# EasyEDA schematic 1-Schematic_电机限流模块 （MOS管）.json
TITLE: Sheet_1; REV: 1.0; Date: 2026-02-02; Sheet: 1/1; Drawn By: ybyllcc; Company: Your Company
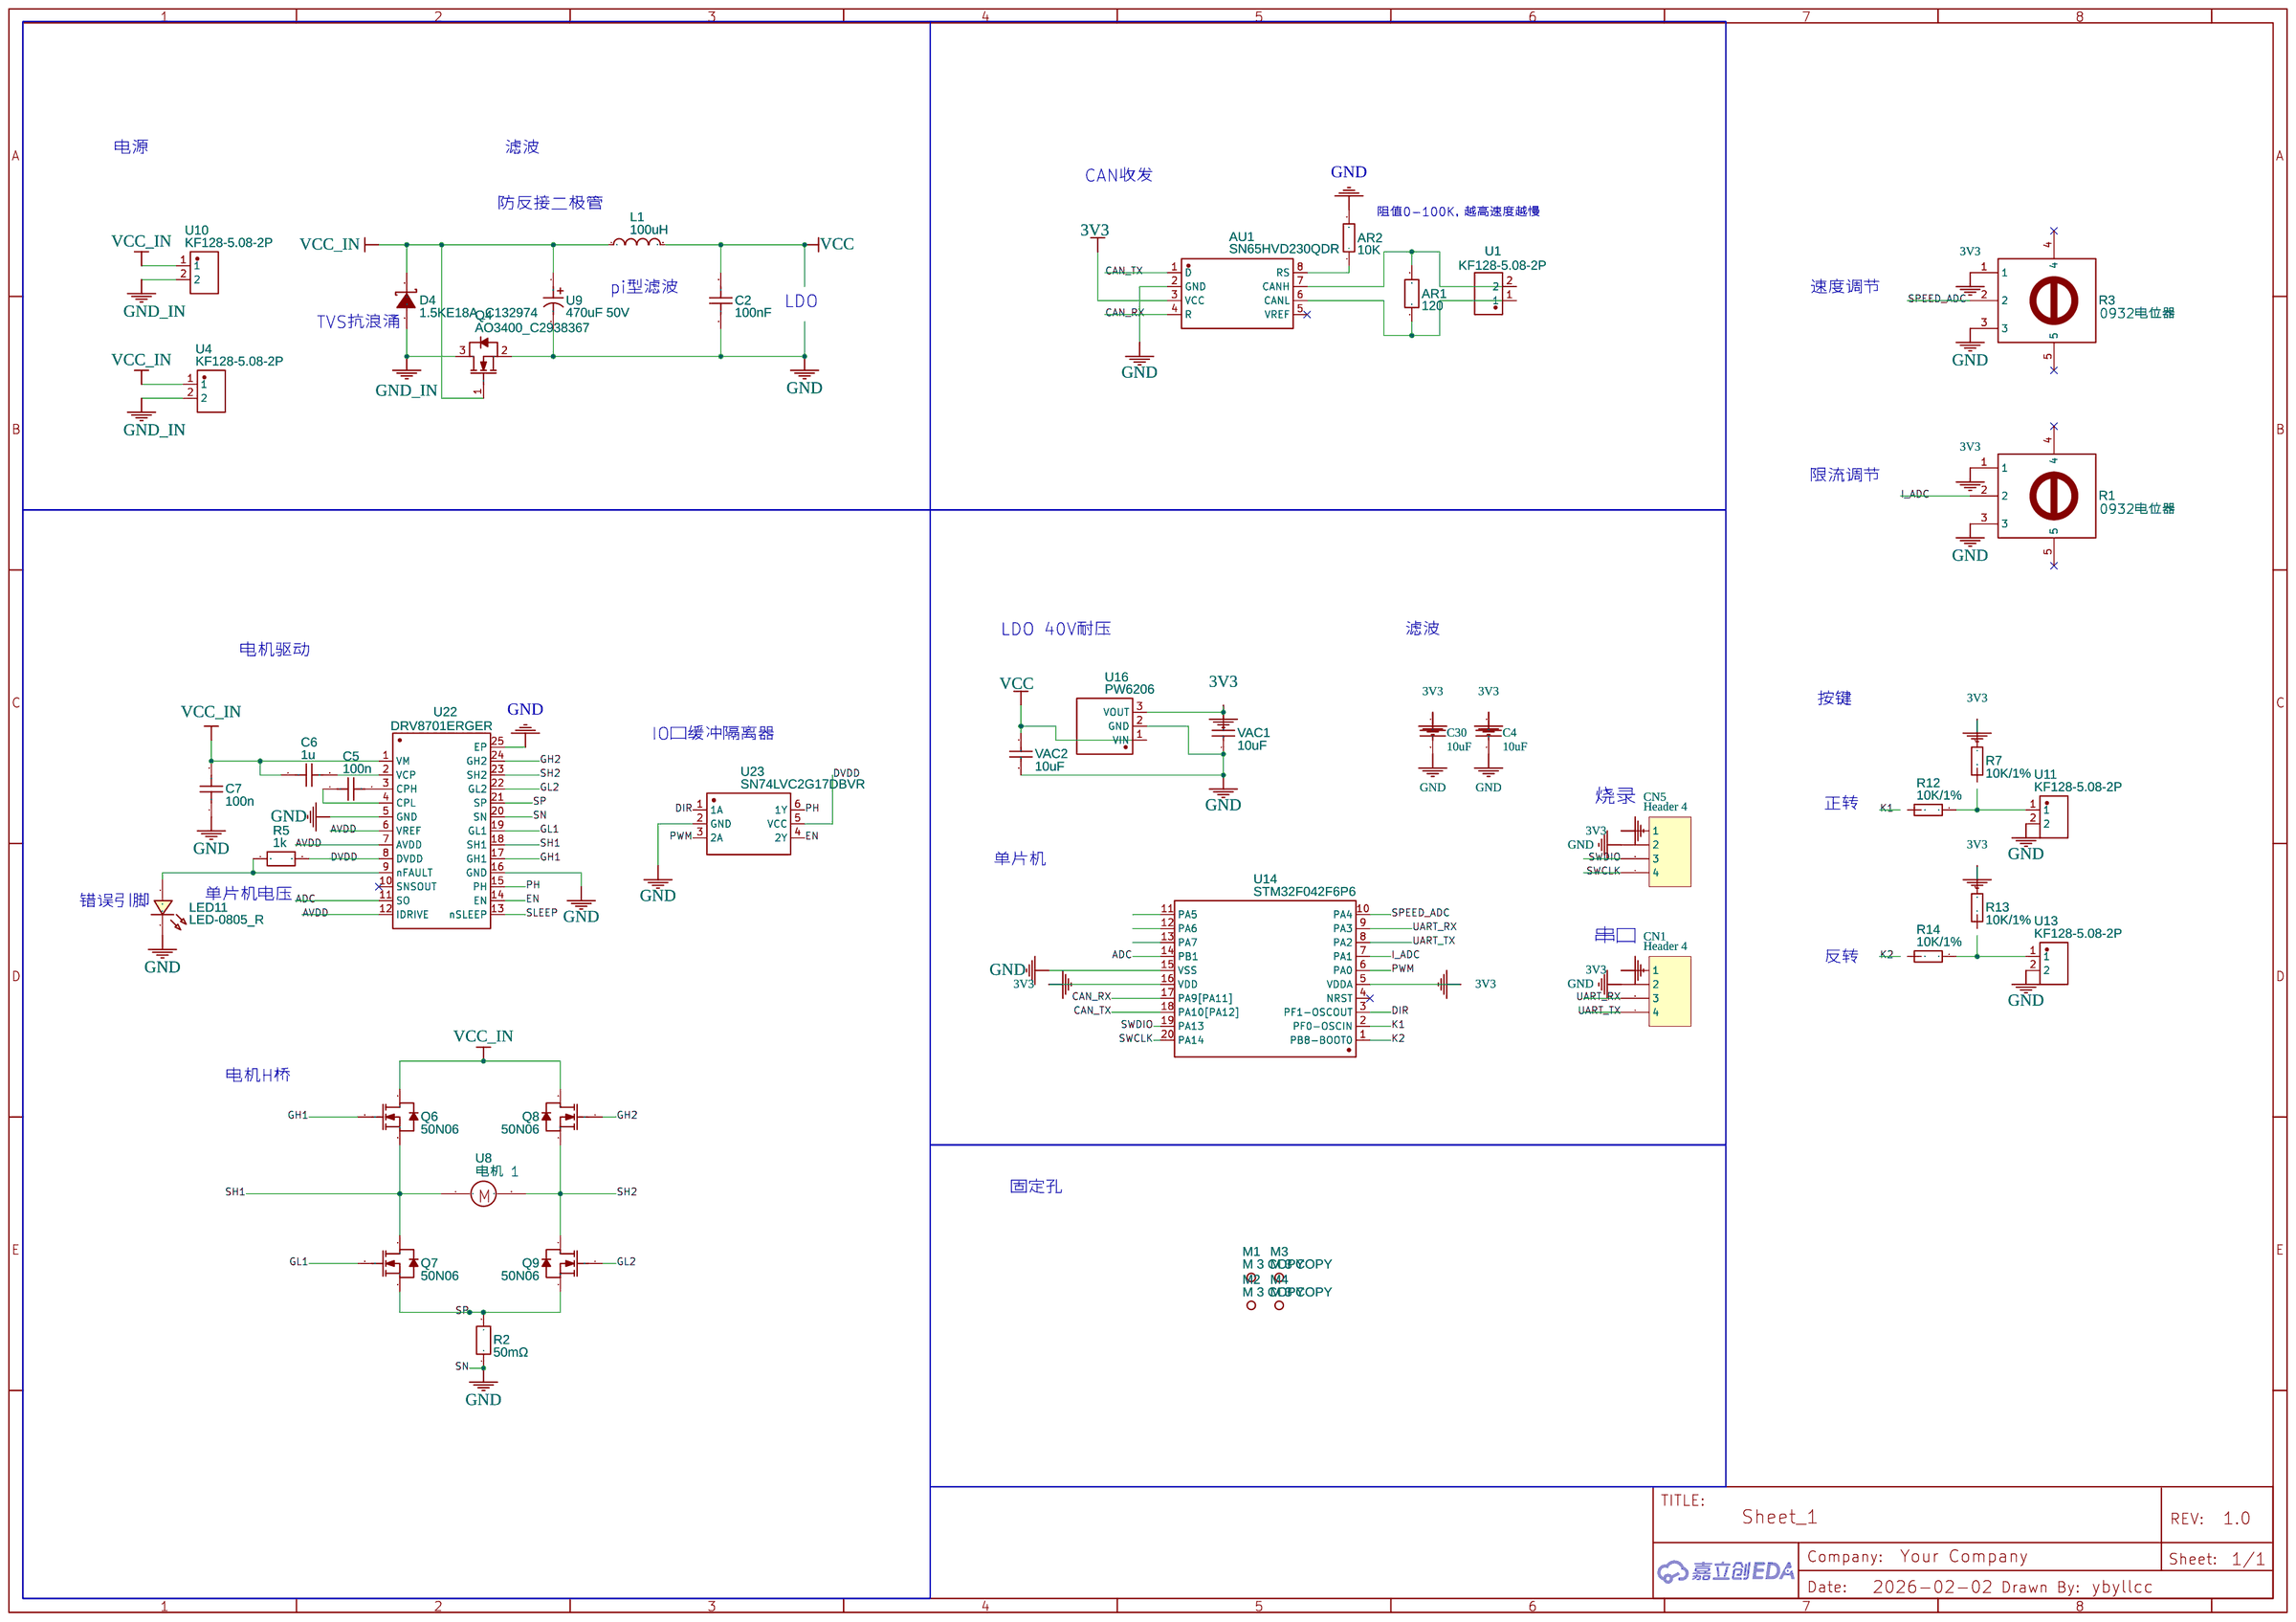
[diagram p0: schematic sheet]

## Parts
AR1  120  [R0603]
AR2  10K  [R0603]
AU1  SN65HVD230QDR  [SOIC-8_L5.0-W4.0-P1.27-LS6.0-BL]
C2  100nF  [C0603]
C4  10uF  [C0603]
C5  100n  [C0603]
C6  1u  [C0603]
C7  100n  [C0603]
C30  10uF  [C0603]
CN1  Header 4  [HDR1X4]
CN5  Header 4  [HDR1X4]
D4  1.5KE18A_C132974  [DO-201_BD5.3-L9.5-P13.50-D1.4-FD]
L1  100uH  [IND-SMD_L5.0-W5.0_FNR50XXS]
LED11  LED-0805_R  [LED0805_GREEN]
M1  M 3 COPY  [M3 固定螺丝过孔 周边不覆铜 圆弧]
M2  M 3 COPY  [M3 固定螺丝过孔 周边不覆铜 圆弧]
M3  M 3 COPY  [M3 固定螺丝过孔 周边不覆铜 圆弧]
M4  M 3 COPY  [M3 固定螺丝过孔 周边不覆铜 圆弧]
Q4  AO3400_C2938367  [SOT-23_L2.9-W1.3-P1.90-LS2.4-BR]
Q6  50N06  [TO-252-2_L6.6-W6.1-P4.57-LS10.1-BR-CW]
Q7  50N06  [TO-252-2_L6.6-W6.1-P4.57-LS10.1-BR-CW]
Q8  50N06  [TO-252-2_L6.6-W6.1-P4.57-LS10.1-BR-CW]
Q9  50N06  [TO-252-2_L6.6-W6.1-P4.57-LS10.1-BR-CW]
R1  0932电位器  [0932立式电位器]
R2  50mΩ  [R2512]
R3  0932电位器  [0932立式电位器]
R5  1k  [R0603]
R7  10K/1%  [0603_R_JX]
R12  10K/1%  [0603_R_JX]
R13  10K/1%  [0603_R_JX]
R14  10K/1%  [0603_R_JX]
U1  KF128-5.08-2P  [CONN-TH_P5.08_KF128-5.08-2P]
U4  KF128-5.08-2P  [CONN-TH_P5.08_KF128-5.08-2P]
U8  电机 1  [CONN-TH_P5.08_KF128-5.08-2P]
U9  470uF 50V  [CAP-TH_BD10.0-P5.00-D0.6-FD]
U10  KF128-5.08-2P  [CONN-TH_P5.08_KF128-5.08-2P]
U11  KF128-5.08-2P  [CONN-TH_P5.08_KF128-5.08-2P]
U13  KF128-5.08-2P  [CONN-TH_P5.08_KF128-5.08-2P]
U14  STM32F042F6P6  [TSSOP-20_L6.5-W4.4-P0.65-LS6.4-BL]
U16  PW6206  [SOT-89-3_L4.5-W2.5-P1.50-LS4.2-BR]
U22  DRV8701ERGER  [VQFN-24_L4.0-W4.0-P0.50-BL-EP2.5]
U23  SN74LVC2G17DBVR  [SOT-23-6_L2.9-W1.6-P0.95-LS2.8-BL]
VAC1  10uF  [C0603]
VAC2  10uF  [C0603]

## Library data of the parts
AR1 = R_0603_EU: Contributor: LCEDA_Lib
AR2 = RMC06035.1K1%N: Supplier: LCSC; Supplier Part: C269716; Manufacturer: Tyohm; Contributor: LCSC
AU1 = SN65HVD230QDR: Supplier: LCSC; Supplier Part: C16468; Manufacturer: Texas Instruments; Contributor: LCSC; LCSC Assembly: Yes; SMT Type: Extend
C2 = CGA0603X7R104K500JT: Supplier: LCSC; Supplier Part: C6119867; Manufacturer: HRE(芯声); JLCPCB Part Class: Extended Part; Contributor: lcsc
C5-C7 = C_0603_US: Contributor: LCEDA_Lib
CN1 CN5 = -: LatestRevisionDate: 17-Jul-2002; LatestRevisionNote: Re-released for DXP Platform.; Publisher: Altium Limited
D4 = 1.5KE18A_C132974: Contributor: LCSC; Supplier: LCSC; Manufacturer: ST(意法半导体); Manufacturer Part: 1.5KE18A; Supplier Part: C132974; JLCPCB Part Class: Extended Part
L1 = FNR5040S101MT: Contributor: LCSC; Supplier: LCSC; Manufacturer: cjiang(长江微电); Supplier Part: C167979; JLCPCB Part Class: Extended Part
LED11 = LED-0805_G: Manufacturer: 国星光电; Manufacturer Part: NCD0805G1; Supplier Part: C84260; Contributor: LCEDA_Lib; Package Display: No
M1 M2 M4 = M 3: Supplier Part: M3; Contributor: hanhan11223
M3 = M 3: Contributor: hanhan11223
Q4 = AO3400_C2938367: Contributor: LCSC; Supplier: LCSC; Supplier Part: C2938367; Manufacturer: GOODWORK(固得沃克); Manufacturer Part: AO3400; JLCPCB Part Class: Extended Part
Q6-Q9 = 50N06: Contributor: LCSC; Supplier: LCSC; Supplier Part: C668201; Manufacturer: UMW(友台半导体); JLCPCB Part Class: Extended Part
R1 R3 = 0932电位器: Contributor: zhaoji
R2 = RE2512F3R010: Supplier: LCSC; Supplier Part: C46961753; Manufacturer: JIERR(捷而瑞); Contributor: lcsc; JLCPCB Part Class: Extended Part
R5 = R_0805_EU: Contributor: LCEDA_Lib
R7 R12-R14 = Resistor: Supplier: LCSC
U1 U4 U10 U11 U13 = KF128-5.08-2P: Contributor: LCSC; Supplier: LCSC; Supplier Part: C474952; Manufacturer: KEFA(科发); Manufacturer Part: KF128-5.08-2P-AA; JLCPCB Part Class: Extended Part
U8 = 电机: Manufacturer: 周爽; Supplier Part: 电机-ZS; Contributor: MCqie
U9 = ERJ1HM471G16C35T: Supplier: LCSC; Supplier Part: C2916286; Manufacturer: AISHI(艾华集团); Contributor: lcsc; JLCPCB Part Class: Extended Part
U14 = STM32F042F6P6: Supplier: LCSC; Manufacturer: ST(意法半导体); Supplier Part: C81000; JLCPCB Part Class: Extended Part
U16 = PW6206: Supplier: LCSC; Supplier Part: C516079; Manufacturer: phaetonsemi; Manufacturer Part: PW6206-SOT89-3; Contributor: 微客; JLCPCB Part Class: Extended Part; link: https://www.semiee.com/file/PWCHIP/PWCHIP-PW6206.pdf
U22 = DRV8701ERGER: Contributor: LCSC; Supplier: LCSC; Supplier Part: C90964; Manufacturer: TI(德州仪器); JLCPCB Part Class: Extended Part
U23 = SN74LVC2G17DBVR: Supplier: LCSC; Manufacturer: TI(德州仪器); Supplier Part: C10429; JLCPCB Part Class: Extended Part
VAC1 VAC2 = CL31A106KAHNNNE: Supplier: LCSC; Manufacturer: SAMSUNG; Supplier Part: C9807; JLCPCB Part Class: Extended Part

## Nets
3V3: AU1.3(VCC) C4.1 C30.1 CN1.1 CN5.1 R1.1 R3.1 R7.1 R13.1 U14.5(VDDA) U14.16(VDD) U16.3(VOUT) VAC1.2
AVDD: U22.6(VREF) U22.7(AVDD) U22.12(IDRIVE)
DVDD: R5.2 U22.8(DVDD) U23.5(VCC)
GND: AR2.2 AU1.2(GND) C2.1 C4.2 C7.1 C30.2 CN1.2 CN5.2 LED11.2 Q4.2(S) R1.3 R2.1 R3.3 U9.2 U11.2 U13.2 U14.15(VSS) U16.2(GND) U22.5(GND) U22.16(GND) U22.20(SN) U22.25(EP) U23.2(GND) VAC1.1 VAC2.1
GND_IN: D4.1(A) Q4.3(D) U4.2 U10.2
VCC: C2.2 L1.2 U16.1(VIN) VAC2.2
VCC_IN: C6.1 C7.2 D4.2(K) L1.1 Q4.1(G) Q6.2(D) Q8.2(D) U4.1 U9.1 U10.1 U22.1(VM)
ADC: U14.14(PB1) U22.11(SO)
CAN_RX: AU1.4(R) U14.17(PA9[PA11])
CAN_TX: AU1.1(D) U14.18(PA10[PA12])
DIR: U14.3(PF1-OSCOUT) U23.1(1A)
EN: U22.14(EN) U23.4(2Y)
GH1: Q6.1(G) U22.17(GH1)
GH2: Q8.1(G) U22.24(GH2)
GL1: Q7.1(G) U22.19(GL1)
GL2: Q9.1(G) U22.22(GL2)
I_ADC: R1.2 U14.7(PA1)
K1: R12.2 U14.2(PF0-OSCIN)
K2: R14.2 U14.1(PB8-BOOT0)
PH: U22.15(PH) U23.6(1Y)
PWM: U14.6(PA0) U23.3(2A)
SH1: Q6.3(S) Q7.2(D) U8.1 U22.18(SH1)
SH2: Q8.3(S) Q9.2(D) U8.2 U22.23(SH2)
SLEEP: U22.13(nSLEEP)
SP: Q7.3(S) Q9.3(S) R2.2 U22.21(SP)
SPEED_ADC: R3.2 U14.10(PA4)
SWCLK: CN5.4 U14.20(PA14)
SWDIO: CN5.3 U14.19(PA13)
UART_RX: CN1.3 U14.9(PA3)
UART_TX: CN1.4 U14.8(PA2)
Net-(AR1-1): AR1.1 AU1.6(CANL) U1.1
Net-(AR1-2): AR1.2 AU1.7(CANH) U1.2
Net-(AR2-1): AR2.1 AU1.8(RS)
Net-(C5-1): C5.1 U22.4(CPL)
Net-(C5-2): C5.2 U22.3(CPH)
Net-(C6-2): C6.2 U22.2(VCP)
Net-(LED11-1): LED11.1 R5.1 U22.9(nFAULT)
Net-(R7-2): R7.2 R12.1 U11.1
Net-(R13-2): R13.2 R14.1 U13.1

Not connected (* = marked no-connect by the designer): AU1 5(VREF)*; R1 4* 5*; R3 4* 5*; U14 4(NRST)* 11(PA5) 12(PA6) 13(PA7); U22 10(SNSOUT)*

## Notes on the sheet
- 电源
- 滤波
- CAN收发
- 防反接二极管
- 阻值0-100K，越高速度越慢
- pi型滤波
- LDO
- 速度调节
- TVS抗浪涌
- 限流调节
- LDO 40V耐压
- 滤波
- 电机驱动
- 按键
- Sleep管脚引入3.3V
  DVDD输出3V3供电
  PH接DIR信号(SN74缓冲）
  EN接PWM信号(SN74缓冲）
- IO口缓冲隔离器
- 烧录
- 正转
- 单片机
- SO输出采样电流转换的电压，给单片机读取
  SP和SN接采样电阻的两端，SN接GND
  采样电阻接下管源极最下面和GND之间
- 单片机电压
- 错误引脚
- 串口
- 反转
- 电机H桥
- 固定孔
